# EAGLE design Prism_Controls (EAGLE 9.6.2)
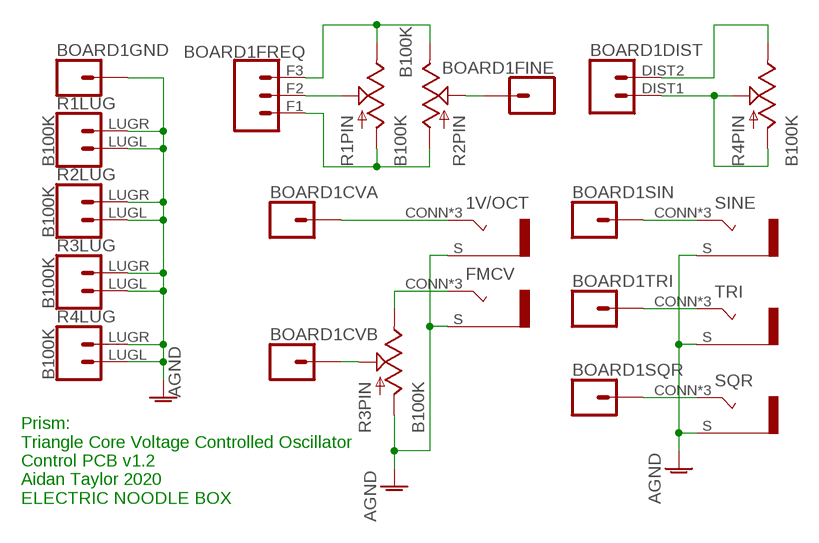
[diagram p0: schematic, sheet 1]

## Parts
1V/OCT  COMBI-JACKCINCHNANA  [NEWCOMBOJACK_PANEL]
BOARD1  PRISM_LINK  [PRISM]
FMCV  COMBI-JACKCINCHNANA  [NEWCOMBOJACK_PANEL]
R1  B100K  POTENTIOMETER  [ALPHA_RV09_9MMPOT]
R2  B100K  POTENTIOMETER  [ALPHA_RV09_9MMPOT]
R3  B100K  POTENTIOMETER  [ALPHA_RV09_9MMPOT]
R4  B100K  POTENTIOMETER  [ALPHA_RV09_9MMPOT]
SINE  COMBI-JACKCINCHNANA  [NEWCOMBOJACK_PANEL]
SQR  COMBI-JACKCINCHNANA  [NEWCOMBOJACK_PANEL]
TRI  COMBI-JACKCINCHNANA  [NEWCOMBOJACK_PANEL]

## Nets
AGND: 1V/OCT.S BOARD1.GNDA BOARD1.GNDB FMCV.S R1.LUGL R1.LUGR R2.LUGL R2.LUGR R3.C1(PIN:A) R3.LUGL R3.LUGR R4.LUGL R4.LUGR SINE.S SQR.S TRI.S
N$1: 1V/OCT.CONN(T) 1V/OCT.T1(T) 1V/OCT.T2(T) BOARD1.CVA
N$2: BOARD1.F1 R1.C1(PIN:A) R2.C1(PIN:A)
N$3: BOARD1.F3 R1.C3(PIN:B) R2.C3(PIN:B)
N$4: BOARD1.F2 R1.C2(PIN:W)
N$5: BOARD1.FINE R2.C2(PIN:W)
N$6: FMCV.CONN(T) FMCV.T1(T) FMCV.T2(T) R3.C3(PIN:B)
N$7: BOARD1.CVB R3.C2(PIN:W)
N$8: BOARD1.DIST1 R4.C1(PIN:A) R4.C2(PIN:W)
N$9: BOARD1.DIST2 R4.C3(PIN:B)
N$10: BOARD1.SIN SINE.CONN(T) SINE.T1(T) SINE.T2(T)
N$11: BOARD1.TRI TRI.CONN(T) TRI.T1(T) TRI.T2(T)
N$12: BOARD1.SQR SQR.CONN(T) SQR.T1(T) SQR.T2(T)

## Notes on the sheet
- Prism: 
  Triangle Core Voltage Controlled Oscillator
  Control PCB v1.2
  Aidan Taylor 2020
  ELECTRIC NOODLE BOX

## Library data of the parts
1V/OCT FMCV SINE SQR TRI = ElectricNoodleBox:COMBI-JACK
BOARD1 = ElectricNoodleBox:PRISM_LINK
R1-R4 = ElectricNoodleBox:POTENTIOMETER

## Board
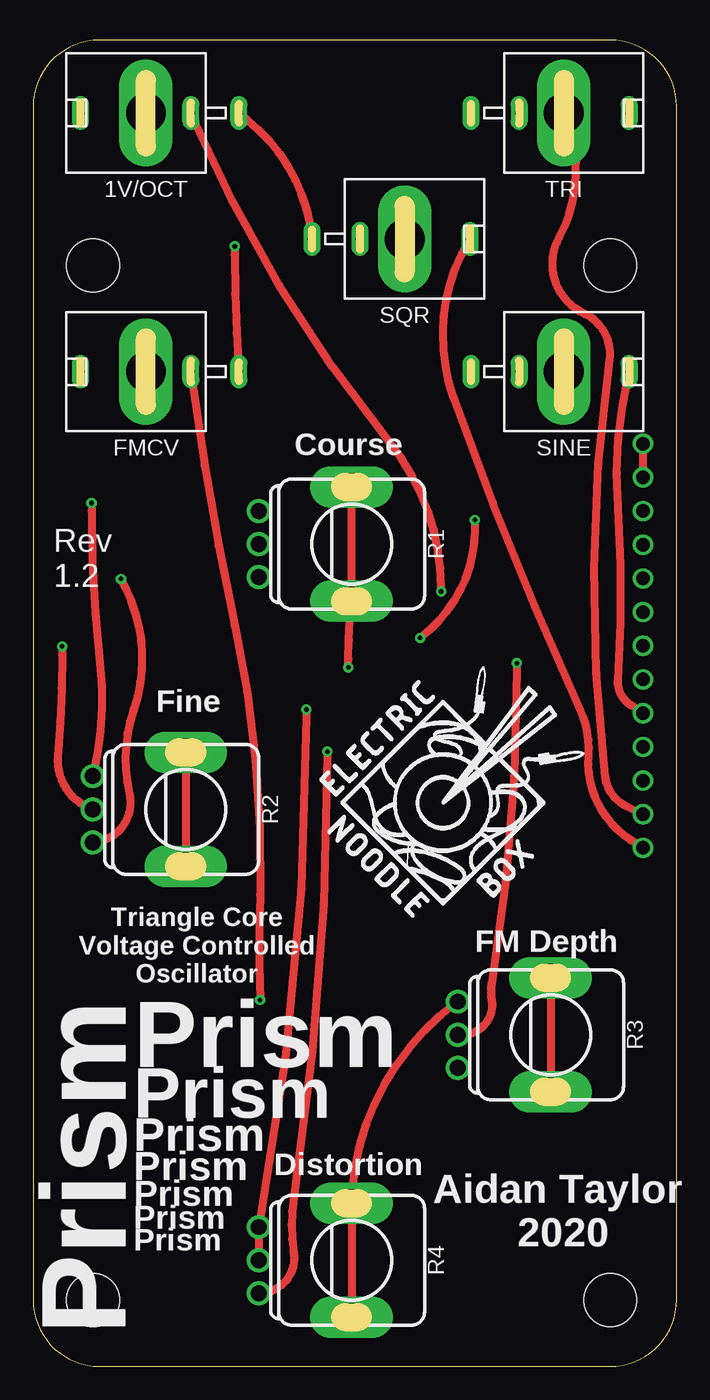
[diagram p1: board, top side]
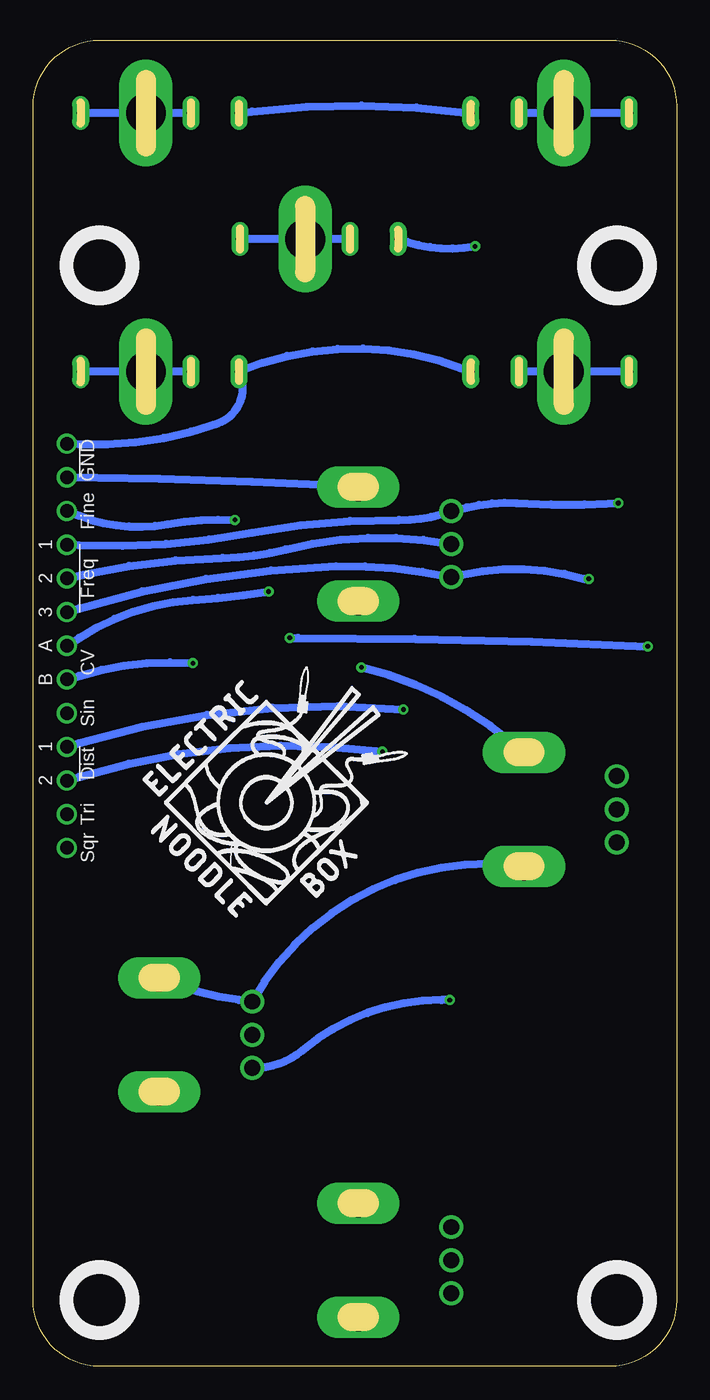
[diagram p2: board, bottom side, seen from below]

Size 48.5 x 100 mm. Coordinates in mm from the lower left corner, seen from the top.
Outline: 0,95 0,5 arc90 5,0 43.5,0 arc90 48.5,5 48.5,95 arc90 43.5,100 5,100 arc90 0,95
Copper layers (1*16): Top 0.035mm / dielectric 1.5mm / Bottom 0.035mm
Design rules "default": minimum track width 6mil, minimum drill 0.35mm, track to track 6mil, track to pad 6mil, pad to pad 6mil, via to via 6mil, smd to smd 6mil, copper to edge 40mil, drill to drill 6mil, minimum pad ring 10mil, minimum via ring 8mil, stop-mask expansion 4mil, vias tented up to drill 0mil, thermal gap 10mil

### Footprints (pad centres in the part's own frame; a part is rotated, then mirrored left to right if it is on the bottom)
NEWCOMBOJACK_PANEL = drill 3 pad 3.6 long: CONN 0,0 | drill 0.6 pad 1.27 long: S 0,-7; T1 0,4.92; T2 0,-3.38
PRISM = drill 1.016: CVA 33.67,2.54; CVB 36.21,2.54; DIST1 41.29,2.54; DIST2 43.83,2.54; F1 26.05,2.54; F2 28.59,2.54; F3 31.13,2.54; FINE 23.51,2.54; GNDA 18.43,2.54; GNDB 20.97,2.54; SIN 38.75,2.54; SQR 48.91,2.54; TRI 46.37,2.54 | hole 4: 5,5; 83,5; 83,44; 5,44
ALPHA_RV09_9MMPOT = drill 1.2 pad 1.778: C1 -2.5,-7; C2 0,-7; C3 2.5,-7 | drill 2.1 pad 2.8 long: LUGL -4.3,0; LUGR 4.3,0

### Placement (x,y rotation side)
1V/OCT  8.5,94.5 90 top
BOARD1  48.5,88 270 bottom
FMCV  8.5,75 90 top
R1  24,62 270 top
R2  11.5,42 270 top
R3  39,25 270 top
R4  24,8 270 top
SINE  40,75 270 top
SQR  28,85 270 top
TRI  40,94.5 270 top
U$1  [LOGO20X20]  21.54,33.34 0 top
U$2  [LOGO20X20]  40.27,33.34 0 bottom

### Tracks (layer width: path | path; a pad name or v marks a point on that pad's centre or on a via)
AGND  (via drill 0.35)
  Top 0.61: 1V/OCT.S 16.14,93.98 arc-45 SQR.S | v15.19,84.45 15.19,83.82 arc4 FMCV.S | v23.77,52.7 23.77,53.34 arc-6 R1.LUGR R1.LUGL | R2.LUGL R2.LUGR | R3.LUGL R3.LUGR | R3.C1 arc49 24.08,13.34 R4.LUGL R4.LUGR | BOARD1.GNDA BOARD1.GNDB
  Bottom 0.61: BOARD1.GNDA 45.04,69.53 arc-22 34.56,71.12 arc-97 SINE.S arc44 16.14,75.25 FMCV.S | R1.LUGL 25.04,66.36 arc-3 BOARD1.GNDB | TRI.S 32.02,94.61 arc14 1V/OCT.S | SQR.S 20.27,84.77 arc-28 v15.19,84.45 | R2.LUGL 12.34,46.99 arc-26 v23.77,52.7 | R2.LUGR 12.34,37.78 arc-66 R3.C1 32.97,27.62 arc17 R3.LUGL
N$1  (via drill 0.35)
  Top 0.61: v30.75,58.42 30.75,58.74 arc39 26.94,69.53 arc-16 1V/OCT.T2
  Bottom 0.61: BOARD1.CVA 45.04,54.93 arc29 36.47,57.78 arc-5 v30.75,58.42 | 1V/OCT.T2 1V/OCT.CONN 1V/OCT.T1
N$2  (via drill 0.35)
  Top 0.61: v4.4,65.09 4.4,64.45 arc6 5.03,53.02 arc-20 R2.C1
  Bottom 0.61: BOARD1.F1 45.04,61.91 arc-13 32.02,62.87 arc12 20.91,63.82 arc-22 R1.C1 15.83,64.77 arc16 12.02,65.09 arc-7 v4.4,65.09
N$3  (via drill 0.35)
  Top 0.61: v6.62,59.37 6.94,58.74 arc-45 7.57,49.53 arc32 7.26,43.18 arc-100 R2.C3
  Bottom 0.61: BOARD1.F3 45.04,57.15 arc15 25.67,60.33 arc14 R1.C3 16.14,59.69 arc29 6.94,59.37 arc-33 v6.62,59.37
N$4
  Bottom 0.61: BOARD1.F2 44.72,59.69 arc12 34.24,60.96 arc-13 29.48,61.59 arc24 R1.C2
N$5  (via drill 0.35)
  Top 0.61: v33.29,63.82 33.29,63.18 arc-53 v29.16,54.93 | v2.17,54.29 2.17,53.66 arc-5 1.86,46.04 arc76 R2.C2
  Bottom 0.61: BOARD1.FINE 45.04,64.14 arc-31 38.37,63.5 arc13 v33.29,63.82 | v29.16,54.93 28.53,54.93 arc3 v2.17,54.29
N$6  (via drill 0.35)
  Top 0.61: FMCV.T2 12.02,73.98 arc5 15.19,55.88 arc-14 17.1,35.56 arc3 v17.1,27.62
  Bottom 0.61: FMCV.T2 FMCV.CONN FMCV.T1 | v17.1,27.62 17.73,27.62 arc-40 28.21,23.81 arc42 R3.C3
N$7  (via drill 0.35)
  Top 0.61: v36.47,53.02 36.47,52.39 arc-9 34.56,28.89 arc19 34.56,27.62 arc-107 R3.C2
  Bottom 0.61: BOARD1.CVB 45.04,52.07 arc21 v36.47,53.02
N$8  (via drill 0.35)
  Top 0.61: v20.59,49.53 20.59,48.9 arc-11 R4.C1 R4.C2
  Bottom 0.61: BOARD1.DIST1 45.04,46.99 arc22 v20.59,49.53
N$9  (via drill 0.35)
  Top 0.61: v22.18,46.35 22.18,46.04 arc-9 19.64,12.7 arc17 19.64,8.57 arc-99 R4.C3
  Bottom 0.61: BOARD1.DIST2 45.04,44.45 arc24 v22.18,46.35
N$10
  Top 0.61: BOARD1.SIN 45.04,49.85 arc-61 44.09,51.75 arc8 44.09,64.77 arc-17 SINE.T1
  Bottom 0.61: SINE.T2 SINE.CONN SINE.T1
N$11
  Top 0.61: BOARD1.TRI 44.72,42.23 arc-57 43.13,44.45 arc-15 43.45,75.88 arc73 41.55,79.38 arc-93 39.64,85.09 arc52 TRI.CONN
  Bottom 0.61: TRI.T2 TRI.CONN TRI.T1
N$12
  Top 0.61: BOARD1.SQR 45.04,39.69 arc-61 41.86,46.04 arc28 41.23,49.53 arc-5 31.7,73.03 arc-51 SQR.T1
  Bottom 0.61: SQR.T1 SQR.CONN SQR.T2

### Text on the board
tPlace: Course | Rev / 1.2 | Fine | Triangle Core / Voltage Controlled / Oscillator | FM Depth | Prism | Prism | Prism | Prism | Prism | Distortion | Prism | Aidan Taylor / 2020 | Prism | Prism